# Altium schematic sheet EVK-NORA-W1_SCHEM_0004_Interface_MCU.SchDoc
size B; Date: 7/24/2020; CompanyName: U-blox; DrawnBy: EMOO; Engineer: EMOO; Organization: U-blox; Address1: 3950 Fairview Industrial Dr SE #100; Address2: Salem, OR 97302; SheetNumber: 4; SheetTotal: 6; SheetSize: B; SheetTitle: Interface MCU
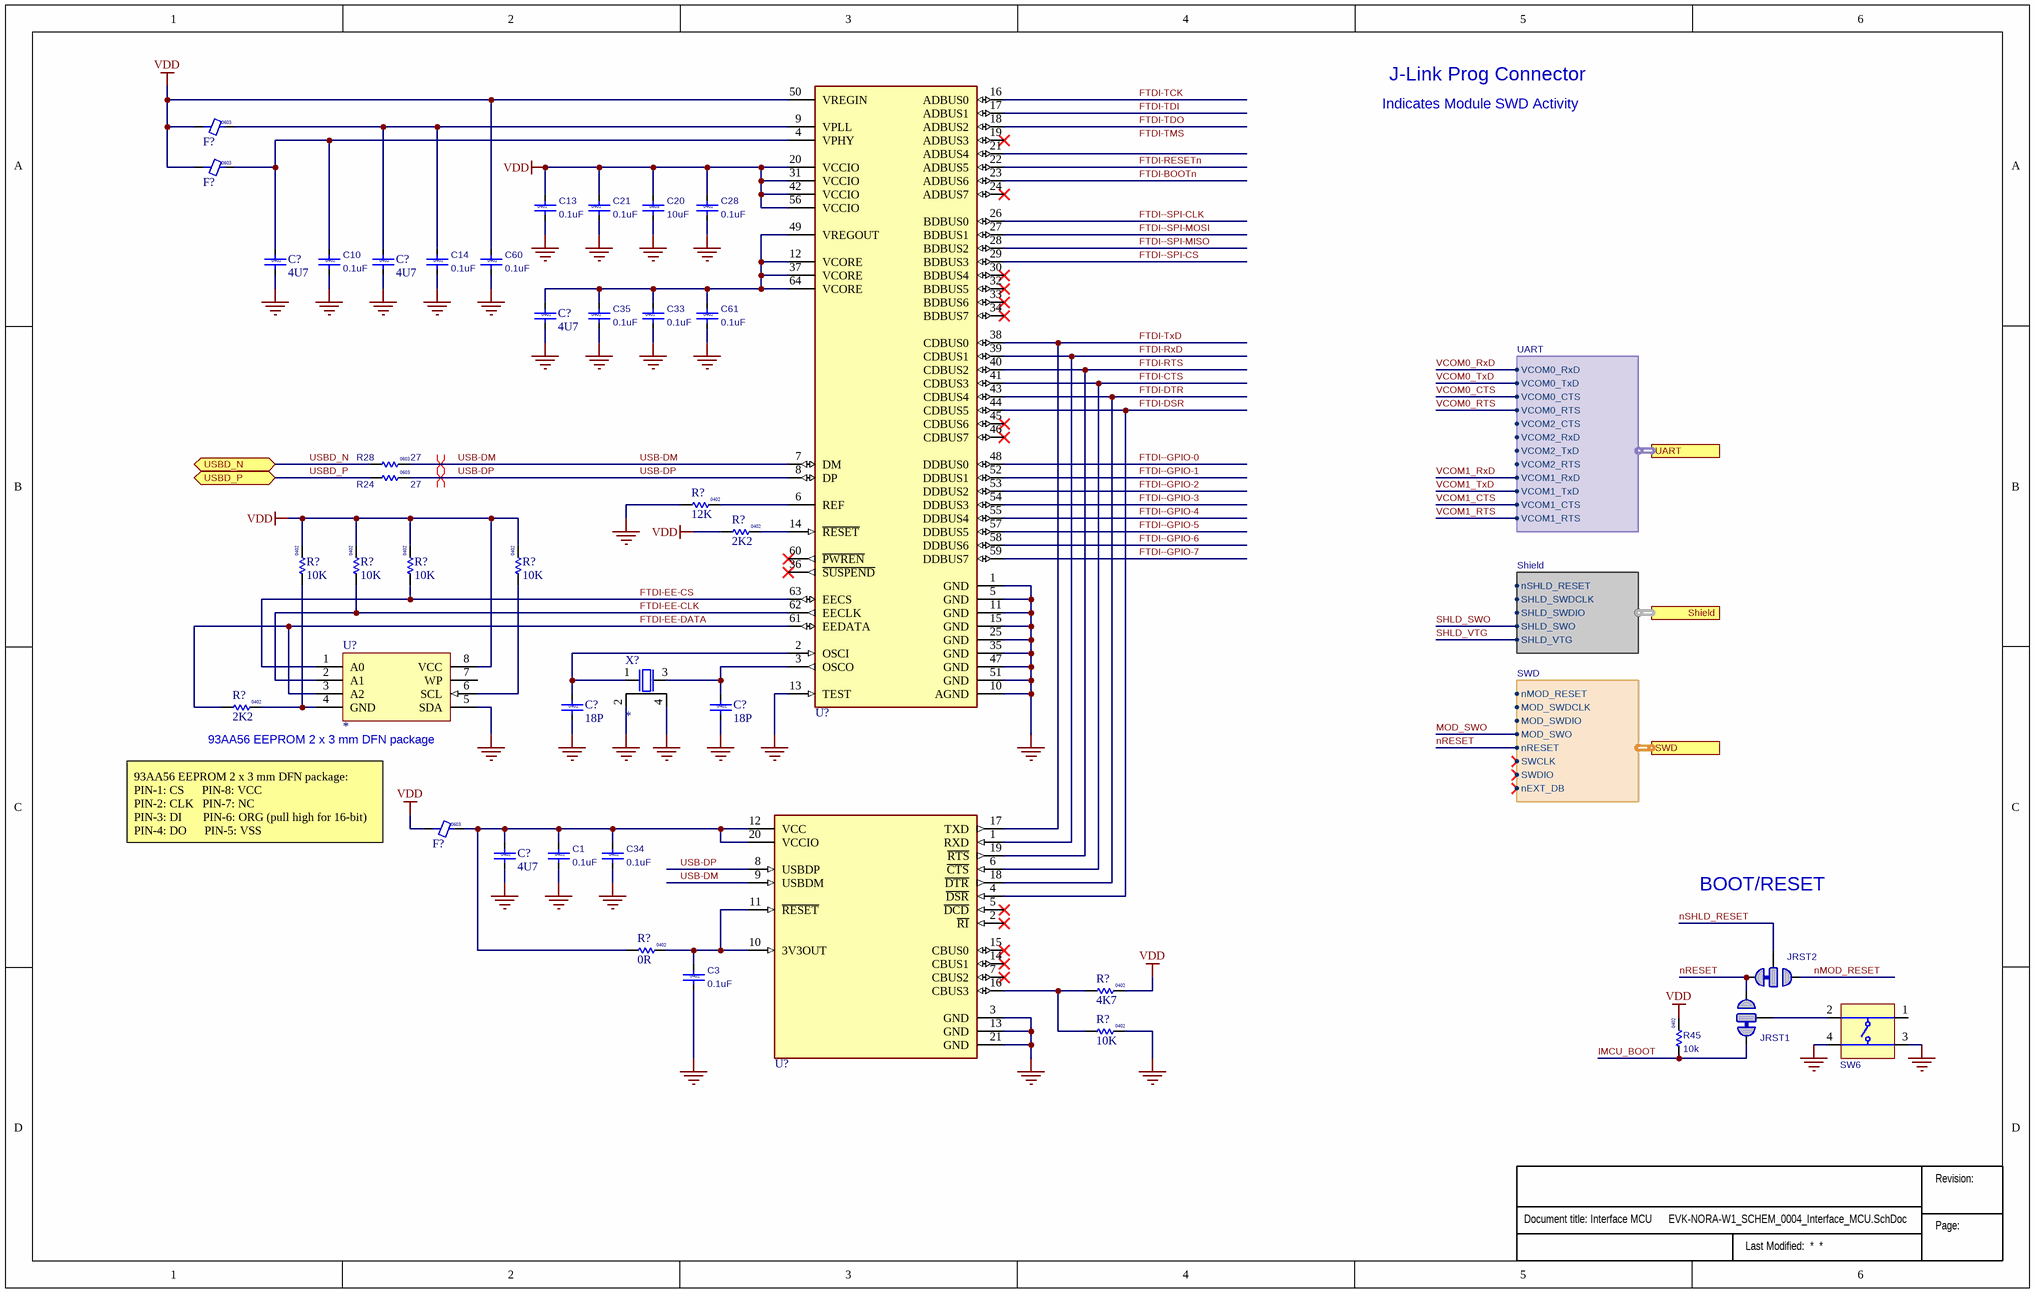
[diagram p0: EVK-NORA-W1_SCHEM_0004_Interface_MCU.SchDoc]

## Parts
(Parts that share a designator on the sheet are numbered #1, #2 ... from top to bottom, then left to right.)
?  (no value)  (graphical)
C1  value 0.1uF  Size: 0402  [Cap 0402 HD]  (hidden comment: 120-000160.1uF)
C3  value 0.1uF  Size: 0402  [Cap 0402 HD]  (hidden comment: 120-000160.1uF)
C10  value 0.1uF  Size: 0402  [Cap 0402 HD]  (hidden comment: 120-000160.1uF)
C13  value 0.1uF  Size: 0402  [Cap 0402 HD]  (hidden comment: 120-000160.1uF)
C14  value 0.1uF  Size: 0402  [Cap 0402 HD]  (hidden comment: 120-000160.1uF)
C20  value 10uF  Size: 0603  [Cap 0603 HD]  (hidden comment: 120-0002410uF)
C21  value 0.1uF  Size: 0402  [Cap 0402 HD]  (hidden comment: 120-000160.1uF)
C28  value 0.1uF  Size: 0402  [Cap 0402 HD]  (hidden comment: 120-000160.1uF)
C33  value 0.1uF  Size: 0402  [Cap 0402 HD]  (hidden comment: 120-000160.1uF)
C34  value 0.1uF  Size: 0402  [Cap 0402 HD]  (hidden comment: 120-000160.1uF)
C35  value 0.1uF  Size: 0402  [Cap 0402 HD]  (hidden comment: 120-000160.1uF)
C60  value 0.1uF  Size: 0402  [Cap 0402 HD]  (hidden comment: 120-000160.1uF)
C61  value 0.1uF  Size: 0402  [Cap 0402 HD]  (hidden comment: 120-000160.1uF)
C?#1  value 4U7  Size: 0402  [Cap 0402 HD]
C?#2  value 4U7  Size: 0402  [Cap 0402 HD]
C?#3  value 4U7  Size: 0402  [Cap 0402 HD]
C?#4  value 18P  Size: 0402  [Cap 0402]
C?#5  value 18P  Size: 0402  [Cap 0402]
C?#6  value 4U7  Size: 0402  [Cap 0402 HD]
F?#1  Size: 0603
F?#2  Size: 0603
F?#3  Size: 0603
JRST1  Solderbridge-OptionDNP  [Solderbridge-Option]  (value not drawn)  (net tie, no BOM)
JRST2  Solderbridge-OptionDNP  [Solderbridge-Option]  (value not drawn)  (net tie, no BOM)
R24  value 27  Size: 0603  [RES 0603 HD]  (hidden comment: 180-0000627)
R28  value 27  Size: 0603  [RES 0603 HD]  (hidden comment: 180-0000627)
R45  value 10k  Size: 0402  [RES 0402 HD]  (hidden comment: 180-0002410k)
R?#1  value 12K  Size: 0402  [RES 0402 HD]
R?#2  value 2K2  Size: 0402  [RES 0402 HD]
R?#3  value 10K  Size: 0402  [RES 0402 HD]
R?#4  value 10K  Size: 0402  [RES 0402 HD]
R?#5  value 10K  Size: 0402  [RES 0402 HD]
R?#6  value 10K  Size: 0402  [RES 0402 HD]
R?#7  value 2K2  Size: 0402  [RES 0402 HD]
R?#8  value 0R  Size: 0402  [RES 0402 HD]
R?#9  value 4K7  Size: 0402  [RES 0402 HD]
R?#10  value 10K  Size: 0402  [RES 0402 HD]
SW6  135-00002  [SW_TACT_SMT_6mm]  (value not drawn)
U?#1  FT4232HL  [QFP0.5P16x16-64Pin_HD]  (value not drawn)
U?#2  (no value)  [DFN0.5P-8Pin_W-Pad]
U?#3  FT231XQ-R  [QFN_5x5_FT231XQ]  (value not drawn)
X?  (no value)  [XTAL_3225]

## Ports
Shield (harness Shield), SWD (harness SWD), UART (harness UART), USBD_N (bidir), USBD_P (bidir)

## Harnesses
UART: VCOM2_TxD, VCOM2_RxD, VCOM2_RTS, VCOM2_CTS, VCOM1_RxD, VCOM1_TxD, VCOM1_CTS, VCOM1_RTS, VCOM0_RxD, VCOM0_TxD, VCOM0_CTS, VCOM0_RTS
SWD: MOD_SWDIO, MOD_SWDCLK, SWCLK, SWDIO, nMOD_RESET, MOD_SWO, nRESET, nEXT_DB
Shield: SHLD_VTG, SHLD_SWDIO, SHLD_SWDCLK, SHLD_SWO, nSHLD_RESET

## Nets
GND: C1.2 C3.2 C10.2 C13.2 C14.2 C20.2 C21.2 C28.2 C33.2 C34.2 C35.2 C60.2 C61.2 C?#1.2 C?#2.2 C?#3.2 C?#4.2 C?#5.2 C?#6.2 R?#1.1 R?#10.2 SW6.3(T3) SW6.4(T3) U?#1.1(GND) U?#1.5(GND) U?#1.10(AGND) U?#1.11(GND) U?#1.13(TEST) U?#1.15(GND) U?#1.25(GND) U?#1.35(GND) U?#1.47(GND) U?#1.51(GND) U?#2.5(SDA) U?#3.3(GND) U?#3.13(GND) U?#3.21(GND) X?.2 X?.4
VDD: C13.1 C20.1 C21.1 C28.1 C60.1 F?#1.1 F?#2.1 F?#3.1 R45.2 R?#2.1 R?#3.2 R?#4.2 R?#5.2 R?#6.2 R?#9.2 U?#1.20(VCCIO) U?#1.31(VCCIO) U?#1.42(VCCIO) U?#1.50(VREGIN) U?#1.56(VCCIO) U?#2.8(VCC)
FTDI--GPIO-0: U?#1.48(DDBUS0)
FTDI--GPIO-1: U?#1.52(DDBUS1)
FTDI--GPIO-2: U?#1.53(DDBUS2)
FTDI--GPIO-3: U?#1.54(DDBUS3)
FTDI--GPIO-4: U?#1.55(DDBUS4)
FTDI--GPIO-5: U?#1.57(DDBUS5)
FTDI--GPIO-6: U?#1.58(DDBUS6)
FTDI--GPIO-7: U?#1.59(DDBUS7)
FTDI--SPI-CLK: U?#1.26(BDBUS0)
FTDI--SPI-CS: U?#1.29(BDBUS3)
FTDI--SPI-MISO: U?#1.28(BDBUS2)
FTDI--SPI-MOSI: U?#1.27(BDBUS1)
FTDI-BOOTn: U?#1.23(ADBUS6)
FTDI-CTS: U?#1.41(CDBUS3) U?#3.6(~{CTS})
FTDI-DSR: U?#1.44(CDBUS5) U?#3.4(~{DSR})
FTDI-DTR: U?#1.43(CDBUS4) U?#3.18(~{DTR})
FTDI-EE-CLK: R?#4.1 U?#1.62(EECLK) U?#2.2(A1)
FTDI-EE-CS: R?#5.1 U?#1.63(EECS) U?#2.1(A0)
FTDI-EE-DATA: R?#7.1 U?#1.61(EEDATA) U?#2.3(A2)
FTDI-RESETn: U?#1.22(ADBUS5)
FTDI-RTS: U?#1.40(CDBUS2) U?#3.19(~{RTS})
FTDI-RxD: U?#1.39(CDBUS1) U?#3.1(RXD)
FTDI-TCK: U?#1.16(ADBUS0)
FTDI-TDI: U?#1.17(ADBUS1)
FTDI-TDO: U?#1.18(ADBUS2)
FTDI-TxD: U?#1.38(CDBUS0) U?#3.17(TXD)
IMCU_BOOT: JRST1.1 R45.1
MOD_SWO: port SWD.MOD_SWO
nMOD_RESET: JRST2.3
nRESET: JRST1.3 JRST2.1 ; port SWD.nRESET
nSHLD_RESET: JRST2.2
SHLD_SWO: port Shield.SHLD_SWO
SHLD_VTG: port Shield.SHLD_VTG
USB-DM: R28.2 U?#1.7(DM) U?#3.9(USBDM)
USB-DP: R24.2 U?#1.8(DP) U?#3.8(USBDP)
USBD_N: R28.1 ; port USBD_N
USBD_P: R24.1 ; port USBD_P
VCOM0_CTS: port UART.VCOM0_CTS
VCOM0_RTS: port UART.VCOM0_RTS
VCOM0_RxD: port UART.VCOM0_RxD
VCOM0_TxD: port UART.VCOM0_TxD
VCOM1_CTS: port UART.VCOM1_CTS
VCOM1_RTS: port UART.VCOM1_RTS
VCOM1_RxD: port UART.VCOM1_RxD
VCOM1_TxD: port UART.VCOM1_TxD
NetC1_1: C1.1 C34.1 C?#6.1 F?#3.2 R?#8.1 U?#3.12(VCC) U?#3.20(VCCIO)
NetC3_1: C3.1 R?#8.2 U?#3.10(3V3OUT) U?#3.11(~{RESET})
NetC10_1: C10.1 C?#1.1 F?#2.2 U?#1.4(VPHY)
NetC14_1: C14.1 C?#2.1 F?#1.2 U?#1.9(VPLL)
NetC33_1: C33.1 C35.1 C61.1 C?#3.1 U?#1.12(VCORE) U?#1.37(VCORE) U?#1.49(VREGOUT) U?#1.64(VCORE)
NetC?#4_1: C?#4.1 U?#1.2(OSCI) X?.1
NetC?#5_1: C?#5.1 U?#1.3(OSCO) X?.3
NetJRST1_2: JRST1.2 SW6.2(T2)
NetR?#1_2: R?#1.2 U?#1.6(REF)
NetR?#2_2: R?#2.2 U?#1.14(~{RESET})
NetR?#3_1: R?#3.1 R?#7.2 U?#2.4(GND)
NetR?#6_1: R?#6.1 U?#2.6(SCL)
NetR?#9_1: R?#9.1 R?#10.1 U?#3.16(CBUS3)

Not connected (* = marked no-connect by the designer): SW6 1(T1); U?#1 19(ADBUS3)* 21(ADBUS4) 24(ADBUS7)* 30(BDBUS4)* 32(BDBUS5)* 33(BDBUS6)* 34(BDBUS7)* 36(~{SUSPEND})* 45(CDBUS6)* 46(CDBUS7)* 60(~{PWREN})*; U?#2 7(WP); U?#3 2(~{RI})* 5(~{DCD})* 7(CBUS2)* 14(CBUS1)* 15(CBUS0)*

## Layout directives
differential pair; net class USB_DIFF: USB-DM, USB-DP

## Notes on the sheet
- J-Link Prog Connector
- Indicates Module SWD Activity
- 93AA56 EEPROM 2 x 3 mm DFN package
- 93AA56 EEPROM 2 x 3 mm DFN package:
  PIN-1: CS      PIN-8: VCC
  PIN-2: CLK   PIN-7: NC
  PIN-3: DI       PIN-6: ORG (pull high for 16-bit)
  PIN-4: DO      PIN-5: VSS
- BOOT/RESET
- Labels drawn without touching a wire or pin: FTDI-TMS
- Revision:
- Page:

## Library data of the parts
? = Sub_Title_Block: Minimized schematic title block for all subset sheets
C1 C3 C10 C13 C14 C21 C28 C33-C35 C60 C61 = 120-00016: Cap, Ceramic 0.1uF 10V 10% X5R 0402; Part Name: CAP CER 0.1UF 10V 10% X5R 0402; Part_Type: Ceramic Capacitor; Manufacturer: Murata Electronics North America; Manufacturer P/N: GRM155R61A104KA01J; Item_Phase: Production; Component Mounting Type: SMT; Tolerance: +/- 10%; Use in new designs: Yes; Part Number: 120-00016; Revision: 0A; Supplier 1: Digi-Key; Supplier Part Number 1: 490-6297-1-ND; Manufacturer 2: Yageo; Manufacturer P/N 2: CC0402KRX5R6BB104; Supplier 2: Digi-Key; Supplier Part Number 2: 311-1336-1-ND; Arena Link: https://app.bom.com/a/GYHPV2L2L43KRMBK?v=spec.summary; Height: 0.55mm; Pins: 2; Temperature Coefficient: X5R; Voltage: 10V
C20 = 120-00024: Cap, Ceramic 10uF 10V 20% X5R 0603; Part Name: CAP CER 10UF 10V 20% X5R 0603; Part_Type: Ceramic Capacitor; Manufacturer: Murata Electronics North America; Manufacturer P/N: GRM188R61A106ME69D; Item_Phase: Preliminary; Component Mounting Type: SMT; Tolerance: +/- 20%; Use in new designs: Yes; Part Number: 120-00024; Supplier 1: Digi-Key; Supplier Part Number 1: 490-10475-1-ND; Arena Link: https://app.bom.com/a/L3MU07Q7Q98PUPRN?v=spec.summary; Height: 0.9mm; Pins: 2; Temperature Coefficient: X5R; Voltage: 10V
C?#1-C?#3 C?#6 = UBXH01-0000243: CAP CER X5R 0402 4U7 20% 10V; Manufacturer: Murata Manufacturing Company, Ltd.; Manufacturer P/N: GRM155R61A475MEAA; Editor: martin.pilik; Released by: fabrice.bret-dibat; Env: GREEN; Permitted Use: Volume Products; Perferred: PREF; Mfg P/N Status: Active; Mfg P/N Split: 100; Mfg P/N Released: Yes; Part Number: UBXH01-0000243; Tolerance: 20%; Max Voltage: 10V; Min Operating Temp: -40°C; Max Operating Temp: 85°C; Part Type: Capacitor; Release Data: 2021-05-10 12:57:47.325652; UBX Wiki: https://wiki.u-blox.com/bin/view/Operations/PartDetails?index=24303; RefDes: C; Mfg P/N Datasheet: https://wiki.u-blox.com/bin/view/Generic/Docs/DocumentSummary?index=24302
C?#4 C?#5 = UBXH01-0004017: CAP CER C0G 0402 18P 5% 25V; Manufacturer: Murata Manufacturing Company, Ltd.; Manufacturer P/N: GRM1555C1H180JA01; Editor: doris.zahnd; Released by: daniel.hurni; Env: ROHS; Permitted Use: Volume Products; Perferred: PREF; Mfg P/N Status: NRND; Mfg P/N Split: 100; Mfg P/N Released: Yes; Part Number: UBXH01-0004017; Tolerance: 5%; Max Voltage: 25V; Min Operating Temp: -55°C; Max Operating Temp: 125°C; Part Type: Capacitor; Release Data: 2009-12-03 17:48:42.813059; UBX Wiki: https://wiki.u-blox.com/bin/view/Operations/PartDetails?index=5178; RefDes: C; Manufacturer 2: Murata Manufacturing Company, Ltd.; Manufacturer P/N 2: GRM1555C1E180JZ01; Mfg P/N Status 2: Obsolete; Mfg P/N Split 2: 0; Mfg P/N Released 2: Yes; Manufacturer 3: Murata Manufacturing Company, Ltd.; Manufacturer P/N 3: GRM1555C1H180JZ01; Mfg P/N Status 3: Obsolete; Mfg P/N Split 3: 0; Mfg P/N Released 3: Yes
F?#1-F?#3 = UBXH08-0000012: FERRITE BEAD MURATA BLM18PG 0603 30R@100MHZ 1A; Manufacturer: Murata Manufacturing Company, Ltd.; Manufacturer P/N: BLM18PG300SN1; Editor: roland.rust; Released by: markus.wejrot; Env: ROHS; Permitted Use: Support Products; Perferred: PREF; Mfg P/N Status: Active; Mfg P/N Split: 100; Mfg P/N Released: Yes; Part Number: UBXH08-0000012; Value: 30R@100MHZ; Max Current: 1A; Min Operating Temp: -40°C; Max Operating Temp: 85°C; Part Type: Ferrite; Release Data: 2015-06-17 16:58:16.722982; UBX Wiki: https://wiki.u-blox.com/bin/view/Operations/PartDetails?index=22261; RefDes: FB
JRST1 JRST2 = Solderbridge-Option: Added By: Paul B; Part Number: Solderbridge-Option; Height: 0; DNP: DNP; Added Date: 12/3/2015
R24 R28 = 180-00006: Resistor 27 ohm 5%, 1/10W, 0603; Part Name: RES SMD 27 OHM 5% 1/10W 0603; Manufacturer: Rohm Semiconductor; Manufacturer P/N: MCR03ERTJ270; Item_Phase: Production; Component Mounting Type: SMT; Tolerance: +/- 5%; Use in new designs: Yes; Part Number: 180-00006; Part_Type: Resistor; Revision: 0A; Supplier 1: Digi-Key; Supplier Part Number 1: RHM27CGCT-ND; Manufacturer 2: Samsung Electro-Mechanics America, Inc; Manufacturer P/N 2: RC1608J270CS; Supplier 2: Digi-Key; Supplier Part Number 2: 1276-5024-1-ND; Arena Link: https://app.bom.com/a/1J2AGN6N6PO6OYQS?v=spec.summary; Height: 0.55mm; Pins: 2; Power: 1/10W; Voltage: N/A
R45 = 180-00024: Resistor 10k ohm 1% 1/16W, 0402; Part Name: RES SMD 10K OHM 1% 1/16W 0402; Manufacturer: Rohm Semiconductor; Manufacturer P/N: MCR01MRTF1002; Item_Phase: Production; Component Mounting Type: SMT; Tolerance: +/- 1%; Use in new designs: Yes; Part Number: 180-00024; Part_Type: Resistor; Revision: 0A; Supplier 1: Digi-Key; Supplier Part Number 1: RHM10.0KCDCT-ND; Manufacturer 2: Samsung Electro-Mechanics America, Inc; Manufacturer P/N 2: RC1005F103CS; Arena Link: https://app.bom.com/a/0I19FM5M5ON4B4RQ?v=spec.summary; Height: 0.4mm; Pins: 2; Power: 1/16W; Voltage: N/A
R?#1 = UBXH18-0000137: RES THICK FILM CHIP 0402 12K 1% 63mW; Manufacturer: Vishay; Manufacturer P/N: CRCW040212K0FKED; Editor: matej.budin; Released by: gabriele.capello; Env: ROHS; Permitted Use: Support Products; Perferred: PREF; Mfg P/N Status: Active; Mfg P/N Split: 100; Mfg P/N Released: Yes; Part Number: UBXH18-0000137; Tolerance: 1%; Max Power: 63mW; Min Operating Temp: -55°C; Max Operating Temp: 125°C; Part Type: Resistor; Release Data: 2014-08-26 10:20:00.142219; UBX Wiki: https://wiki.u-blox.com/bin/view/Operations/PartDetails?index=21075; RefDes: R; Mfg P/N Datasheet: https://wiki.u-blox.com/bin/view/Generic/Docs/DocumentSummary?index=21077
R?#2 R?#7 = UBXH18-0008057: RES THICK FILM CHIP 0402 2K2 5% 100mW; Manufacturer: YAGEO; Manufacturer P/N: 2322_705_87222_L; Editor: roland.rust; Env: ROHS; Permitted Use: Volume Products; Perferred: PREF; Mfg P/N Status: NRND; Mfg P/N Split: 100; Mfg P/N Released: Yes; Part Number: UBXH18-0008057; Tolerance: 5%; Max Power: 100mW; Part Type: Resistor; Released by: roland.rust; Release Data: 2007-02-09 10:46:57; UBX Wiki: https://wiki.u-blox.com/bin/view/Operations/PartDetails?index=6956; RefDes: R; Manufacturer 2: YAGEO; Manufacturer P/N 2: RC0402JR-072K2L; Mfg P/N Status 2: Active; Mfg P/N Split 2: 0; Mfg P/N Released 2: Yes; Mfg P/N Datasheet 2: https://wiki.u-blox.com/bin/view/Generic/Docs/DocumentSummary?index=8163
R?#3-R?#6 R?#10 = UBXH18-0008073: RES THICK FILM CHIP 0402 10K 5% 100mW; Manufacturer: KOA; Manufacturer P/N: RK73B1ETTD103J; Editor: martin.frauchiger; Env: ROHS; Permitted Use: Volume Products; Perferred: PREF; Mfg P/N Status: NRND; Mfg P/N Split: 100; Mfg P/N Released: Yes; Part Number: UBXH18-0008073; Tolerance: 5%; Max Power: 100mW; Part Type: Resistor; Released by: martin.frauchiger; Release Data: 2005-08-19 10:42:45; UBX Wiki: https://wiki.u-blox.com/bin/view/Operations/PartDetails?index=6981; RefDes: R; Manufacturer 2: YAGEO; Manufacturer P/N 2: RC0402JR-0710KL; Mfg P/N Status 2: Active; Mfg P/N Split 2: 0; Mfg P/N Released 2: No; Manufacturer 3: YAGEO; Manufacturer P/N 3: 2322_705_87103_L; Mfg P/N Status 3: NRND; Mfg P/N Split 3: 0; Mfg P/N Released 3: Yes
R?#8 = UBXH18-0003002: RES THICK FILM CHIP 0402 0R 0 100mW; Manufacturer: KOA; Manufacturer P/N: RK73Z1ETTD; Tolerance: 0; Editor: charlotte.biber; Released by: peter.mueller; Env: ROHS; Permitted Use: Volume Products; Perferred: PREF; Mfg P/N Status: NRND; Mfg P/N Split: 100; Mfg P/N Released: Yes; Part Number: UBXH18-0003002; Max Power: 100mW; Part Type: Resistor; Release Data: 2012-06-05 09:49:55.978616; UBX Wiki: https://wiki.u-blox.com/bin/view/Operations/PartDetails?index=6611; RefDes: R; Manufacturer 2: YAGEO; Manufacturer P/N 2: 2322_705_91001_L; Mfg P/N Status 2: NRND; Mfg P/N Split 2: 0; Mfg P/N Released 2: Yes
R?#9 = UBXH18-0008065: RES THICK FILM CHIP 0402 4K7 5% 100mW; Manufacturer: YAGEO; Manufacturer P/N: 2322_705_70472_L; Editor: martin.frauchiger; Env: ROHS; Permitted Use: Volume Products; Perferred: PREF; Mfg P/N Status: NRND; Mfg P/N Split: 100; Mfg P/N Released: Yes; Part Number: UBXH18-0008065; Tolerance: 5%; Max Power: 100mW; Part Type: Resistor; Released by: martin.frauchiger; Release Data: 2005-08-19 10:42:45; UBX Wiki: https://wiki.u-blox.com/bin/view/Operations/PartDetails?index=6969; RefDes: R; Manufacturer 2: KOA; Manufacturer P/N 2: RK73B1ETTD472J; Mfg P/N Status 2: NRND; Mfg P/N Split 2: 0; Mfg P/N Released 2: Yes
SW6 = 135-00002: Tactile Switch, SPST-NO, SMT 160gf.; Part Name: Button Tactile SPST-NO 50mA 6mm SMT; Part_Type: Button; Manufacturer: C&K Components; Manufacturer P/N: PTS645SM43SMTR92 LFS; Item_Phase: Preliminary; Body Size: 6mm x 6mm; Current: 50mA; Switch/Button Circuit: SPST; Switch/Button Function: Off-Mom; Use in new designs: Yes; Voltage: 12VDC; Part Number: 135-00002; Supplier 1: Digi-Key; Supplier Part Number 1: CKN9112CT-ND; Arena Link: https://app.bom.com/a/L3MU07Q7Q98QQQW6?v=spec.summary; Component Mounting Type: SMT; Height: 4.3mm; Pins: 4
U?#1 = UBXH10-0000092: FTDI FT4232HL QUAD HIGH SPEED USB TO MULTIPURPOSE UART LQFP-64; Manufacturer: FTDI Future Technology Devices International; Editor: olof.viklund; Released by: aneeb.sohail; Env: ROHS; Permitted Use: Support Products; Perferred: PREF; Mfg P/N Status: Active; Mfg P/N Split: 100; Mfg P/N Released: No; Part Number: UBXH10-0000092; Value: FT4232HL; Min Operating Temp: -40°C; Max Operating Temp: 85°C; Part Type: Interface; Release Data: 2021-08-27 14:44:23.358237; UBX Wiki: https://wiki.u-blox.com/bin/view/Operations/PartDetails?index=35482; RefDes: U; Manufacturer P/N: FT4232HL; Mfg P/N Datasheet: https://wiki.u-blox.com/bin/view/Generic/Docs/DocumentSummary?index=16016
U?#2 = 240-00003: EEPROM I2C, 32KBIT 400KHZ, 8- DFN 2mm x 3mm; Manufacturer 1: Rohm Semiconductor; Manufacturer Part Number 1: BR24T32NUX-WTR; Part Name: IC EEPROM 32KBIT 400KHZ 8UDFN; Body Size: 3mm x 2mm; Item Phase: In Production; Memory Size: 32Kb; Memory Speed: None; MFG Package: UDFN8; SMT Pitch: 0.5mm; Use in new designs: Yes; Voltage: 5.5V; Manufacturer P/N: *; Part Number: 240-00003; Supplier 1: Digi-Key; Supplier Part Number 1: BR24T32NUX-WCT-ND; Height: 0.6mm; Interface: I2C; Memory Type: EEPROM; Max Operating Temp: 85; Min Operating Temp: -40; Pins: 8; Revision: 0A; Thermal Pad: None; UBX Code: None; Manufacturer 2: ON Semiconductor; Manufacturer Part Number 2: CAT24C32HU4I-GT3; Supplier 2: Digi-Key; Supplier Part Number 2: CAT24C32HU4I-GT3OSCT-ND
U?#3 = UBXH10-0000054: FTDI USB TO SERIAL FULL UART INTERFACE QFN20; Manufacturer: FTDI Future Technology Devices International; Editor: adam.johansson; Env: ROHS; Permitted Use: Support Products; Perferred: PREF; Mfg P/N Status: Active; Mfg P/N Split: 100; Mfg P/N Released: No; Part Number: UBXH10-0000054; Value: FT231XQ-R; Min Operating Temp: -40°C; Max Operating Temp: 85°C; Part Type: Interface; UBX Wiki: https://wiki.u-blox.com/bin/view/Operations/PartDetails?index=27258; RefDes: U; Manufacturer P/N: FT231XQ-R; Mfg P/N Datasheet: https://wiki.u-blox.com/bin/view/Generic/Docs/DocumentSummary?index=33707
X? = 100-00006: XTAL, 4Pin, 12.0000MHz, 18pF, 20ppm, 4Pins; Manufacturer 1: Abracon LLC; Manufacturer Part Number 1: ABM8-12.000MHZ-B2-T; Part Name: XTAL 12MHz 18pF 20ppm 3225; Body Size: 3.2mm x 2.5mm; Item Phase: Unreleased; MFG Package: 4-SMD; Use in new designs: Yes; Voltage: None; Value: *; Part Number: 100-00006; Supplier 1: Digi-Key; Supplier Part Number 1: 535-9826-1-ND; Manufacturer 2: AVX Corporation; Manufacturer Part Number 2: CX3225GB12000P0HPQCC; Supplier 2: Digi-Key; Supplier Part Number 2: 1253-1168-1-ND; Height: 0.8mm; Max Operating Temp: 75; Min Operating Temp: -20; Pins: 4; Revision: None; UBX Code: None